# Altium schematic sheet TRNG_ying.SchDoc: TRNG
size A4; DrawnBy: framist
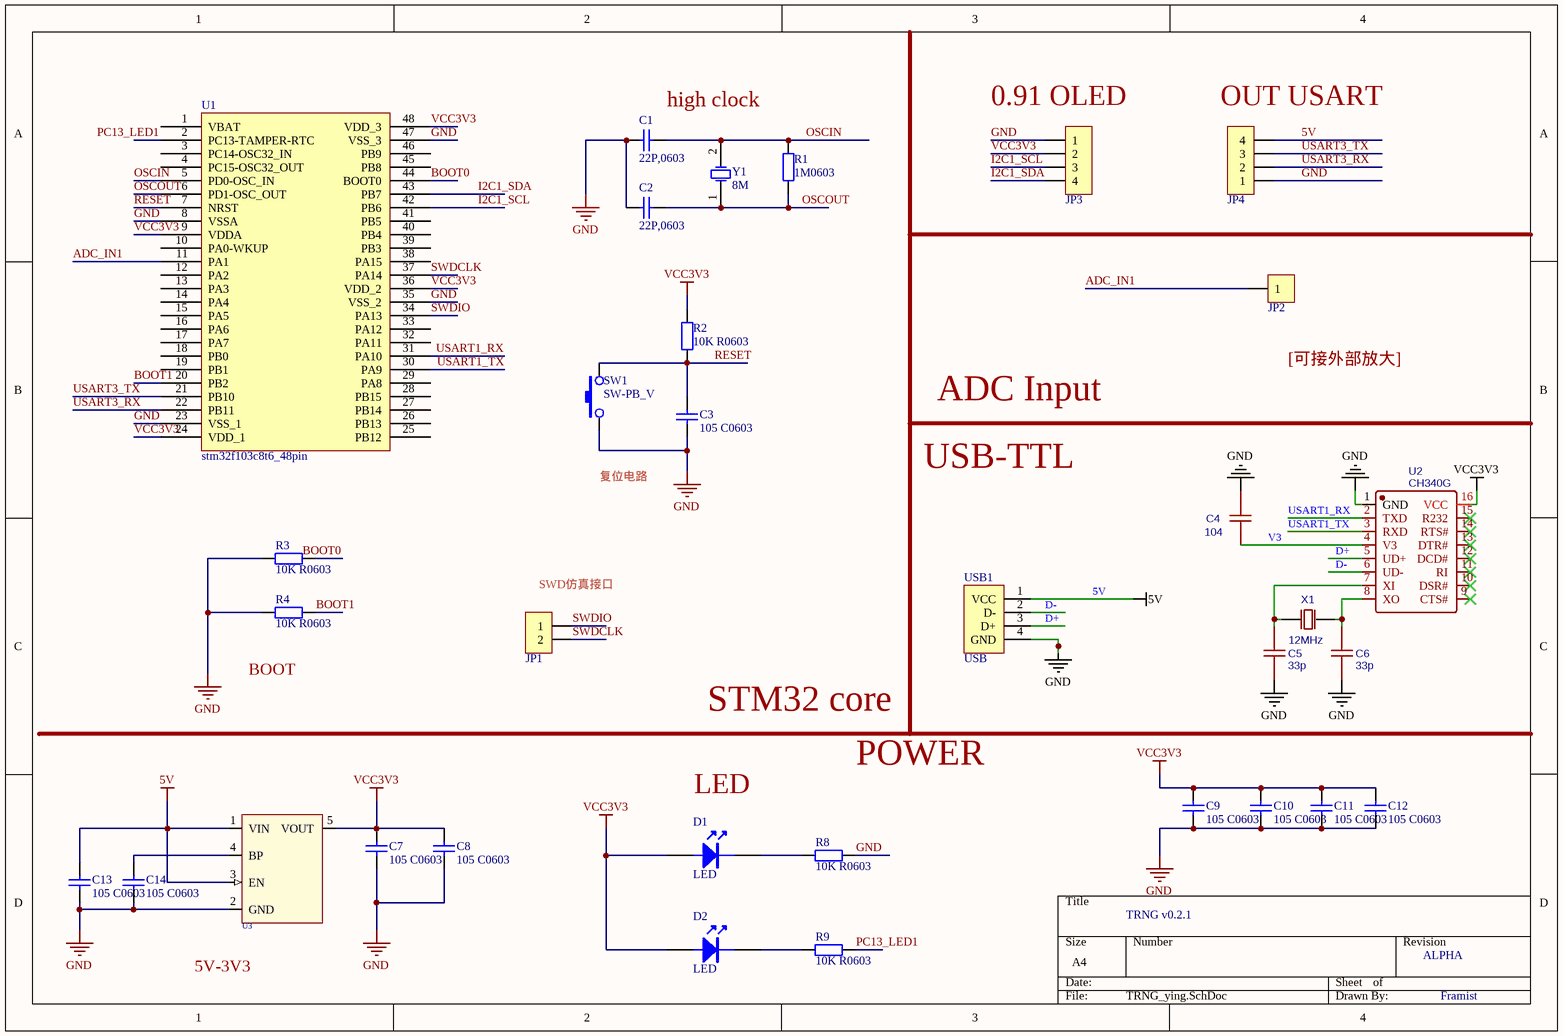
[diagram p0: TRNG_ying.SchDoc]

## Parts
C1  22P,0603  [C 0603]
C2  22P,0603  [C 0603]
C3  105 C0603  [C 0603]
C4  104  [C 0603]
C5  33p  [C 0603]
C6  33p  [C 0603]
C7  105 C0603  [C 0603]
C8  105 C0603  [C 0603]
C9  105 C0603  [C 0603]
C10  105 C0603  [C 0603]
C11  105 C0603  [C 0603]
C12  105 C0603  [C 0603]
C13  105 C0603  [C 0603]
C14  105 C0603  [C 0603]
D1  LED  [LED 0805G]
D2  LED  [LED 0805G]
JP1  HDR-1X2  [HDR-1X2]  (value not drawn)
JP2  HDR-1X1  [HDR-1X1]  (value not drawn)
JP3  HDR-1X4  [HDR-1X4]  (value not drawn)
JP4  HDR-1X4  [HDR-1X4]  (value not drawn)
R1  1M0603  [R 0603]
R2  10K R0603  [R 0603]
R3  10K R0603  [R 0603]
R4  10K R0603  [R 0603]
R8  10K R0603  [R 0603]
R9  10K R0603  [R 0603]
SW1  SW-PB_V  [TSW SMD-3*6*2.5]
U1  stm32f103c8t6_48pin  [TQFP48 7x7_L]
U2  CH340G  [SOP16_M]
U3  RT9193  [SOT23-5L]  (value not drawn)
USB1  USB  [USB_A/P_A]
X1  12MHz  [XTAL-49S DIP]
Y1  8M  [XTAL-49S DIP]

## Nets
5V: C13.2 JP4.4 U3.1(VIN) U3.3(EN) USB1.1(VCC)
GND: C1.2 C2.2 C3.1 C4.2 C5.1 C6.1 C7.1 C8.1 C9.1 C10.1 C11.1 C12.1 C13.1 C14.1 JP3.1 JP4.1 R3.2 R4.1 R8.2 SW1.1 U1.8(VSSA) U1.23(VSS_1) U1.35(VSS_2) U1.47(VSS_3) U2.1(GND) U3.2(GND) USB1.4(GND)
VCC3V3: C7.2 C8.2 C9.2 C10.2 C11.2 C12.2 D1.1 D2.1 JP3.2 R2.2 U1.9(VDDA) U1.24(VDD_1) U1.36(VDD_2) U1.48(VDD_3) U2.16(VCC) U3.5(VOUT)
ADC_IN1: JP2.1 U1.11(PA1)
BOOT0: R3.1 U1.44(BOOT0)
BOOT1: R4.2 U1.20(PB2)
D+: U2.5(UD+) USB1.3(D+)
D-: U2.6(UD-) USB1.2(D-)
I2C1_SCL: JP3.3 U1.42(PB6)
I2C1_SDA: JP3.4 U1.43(PB7)
OSCIN: C1.1 R1.2 U1.5(PD0-OSC_IN) Y1.2(OSC2)
OSCOUT: C2.1 R1.1 U1.6(PD1-OSC_OUT) Y1.1(OSC1)
PC13_LED1: R9.2 U1.2(PC13-TAMPER-RTC)
RESET: C3.2 R2.1 SW1.2 U1.7(NRST)
SWDCLK: JP1.2 U1.37(PA14)
SWDIO: JP1.1 U1.34(PA13)
USART1_RX: U1.31(PA10) U2.2(TXD)
USART1_TX: U1.30(PA9) U2.3(RXD)
USART3_RX: JP4.2 U1.22(PB11)
USART3_TX: JP4.3 U1.21(PB10)
V3: C4.1 U2.4(V3)
NetC5_2: C5.2 U2.7(XI) X1.2(OSC2)
NetC6_2: C6.2 U2.8(XO) X1.1(OSC1)
NetC14_2: C14.2 U3.4(BP)
NetD1_2: D1.2 R8.1
NetD2_2: D2.2 R9.1

Not connected (* = marked no-connect by the designer): U1 1(VBAT) 3(PC14-OSC32_IN) 4(PC15-OSC32_OUT) 10(PA0-WKUP) 12(PA2) 13(PA3) 14(PA4) 15(PA5) 16(PA6) 17(PA7) 18(PB0) 19(PB1) 25(PB12) 26(PB13) 27(PB14) 28(PB15) 29(PA8) 32(PA11) 33(PA12) 38(PA15) 39(PB3) 40(PB4) 41(PB5) 45(PB8) 46(PB9); U2 9(CTS#)* 10(DSR#)* 11(RI)* 12(DCD#)* 13(DTR#)* 14(RTS#)* 15(R232)*

## Notes on the sheet
- high clock
- (near JP3) 0.91 OLED
- (near JP4) OUT USART
- [可接外部放大]
- ADC Input
- 复位电路
- USB-TTL
- (near JP1) SWD仿真接口
- (near R4) BOOT
- STM32 core
- POWER
- LED
- TRNG v0.2.1
- (near U3) 5V-3V3
- ALPHA
- Framist

## Library data of the parts
C1 C2 = Cap: Capacitor; Value: 104; Published: 8-Jun-2000; LatestRevisionDate: 17-Jul-2002; LatestRevisionNote: Re-released for DXP Platform.; Publisher: Altium Limited
C3 C7-C14 = Cap: Value: 104; Published: 8-Jun-2000; LatestRevisionDate: 17-Jul-2002; LatestRevisionNote: Re-released for DXP Platform.; Publisher: Altium Limited
C4 = 104: BOM_Manufacturer: Samsung Electro-Mechanics; BOM_Manufacturer Part: CL10C330JC81PNC; nameAlias: Capacitance; Contributor: LCSC; BOM_Supplier: LCSC; BOM_Supplier Part: C472790; spicePre: C; spiceSymbolName: CL10C330JC81PNC
C5 C6 = 33p: BOM_Manufacturer: Samsung Electro-Mechanics; BOM_Manufacturer Part: CL10C330JC81PNC; nameAlias: Capacitance; Contributor: LCSC; BOM_Supplier: LCSC; BOM_Supplier Part: C472790; spicePre: C; spiceSymbolName: CL10C330JC81PNC
JP1 = Header 2: 2P接插件; 版权归属: 源创客; BOM名称: 2P接插件; 学习资源: www.ooocke.com
JP2 = Header 1: 1P接插件; 版权归属: 源创客; BOM名称: 1P接插件; 学习资源: www.ooocke.com
JP3 JP4 = Header 4: 4P接插件; 版权归属: 源创客; BOM名称: 4P接插件; 学习资源: www.ooocke.com
R1 = Res2: Resistor; Published: 8-Jun-2000; LatestRevisionDate: 17-Jul-2002; LatestRevisionNote: Re-released for DXP Platform.; Publisher: Altium Limited
R2-R4 R8 R9 = Res2: Published: 8-Jun-2000; LatestRevisionDate: 17-Jul-2002; LatestRevisionNote: Re-released for DXP Platform.; Publisher: Altium Limited
U2 = CH340G: BOM_Manufacturer: WCH; SMT Type: Basic; timeStamp: 1468327462; BOM_Supplier: LCSC; BOM_Manufacturer Part: CH340G; BOM_LCSC Assembly: Yes; image: //image.lceda.cn/szlcsc/C14267.jpg; BOM_Supplier Part: C14267; spicePre: U; spiceSymbolName: CH340G
U3 = RT9193X_5P: ICA_MFR_NAME: RICHTEK; ICA_PARTNUM: $$2191094$$RT9193-15CU5; Part Number: TMP-13
USB1 = USB-A/P: USB-A型公接口; 版权归属: 源创客; BOM名称: USB-A型公接口; 学习资源: www.ooocke.com
X1 = 12MHz: BOM_Manufacturer: TAITIEN Elec; BOM_Manufacturer Part: XSHEELNANF-12MHZ; nameAlias: Frequency; Contributor: LCSC; SMT Type: Extend; BOM_Supplier: LCSC; BOM_Supplier Part: C295065; BOM_LCSC Assembly: Yes; spicePre: X; spiceSymbolName: XSHEELNANF-12MHZ
Y1 = XTAL: Crystal Oscillator; Published: 8-Jun-2000; LatestRevisionDate: 17-Jul-2002; LatestRevisionNote: Re-released for DXP Platform.; Publisher: Altium Limited